# EasyEDA Pro project ProPrj_Flight Radar_Time Sketch_2026-05-02.epro

# Schematic Schematic1
Board Name: Board1; Create Date: 2026-01-16; Page Name: P1; Project Name: Flight Radar/Time Sketch; Schematic Name: Schematic1; Update Date: 2026-01-16; Company: EasyEDA.com; Page Size: A4; Version: V1.0
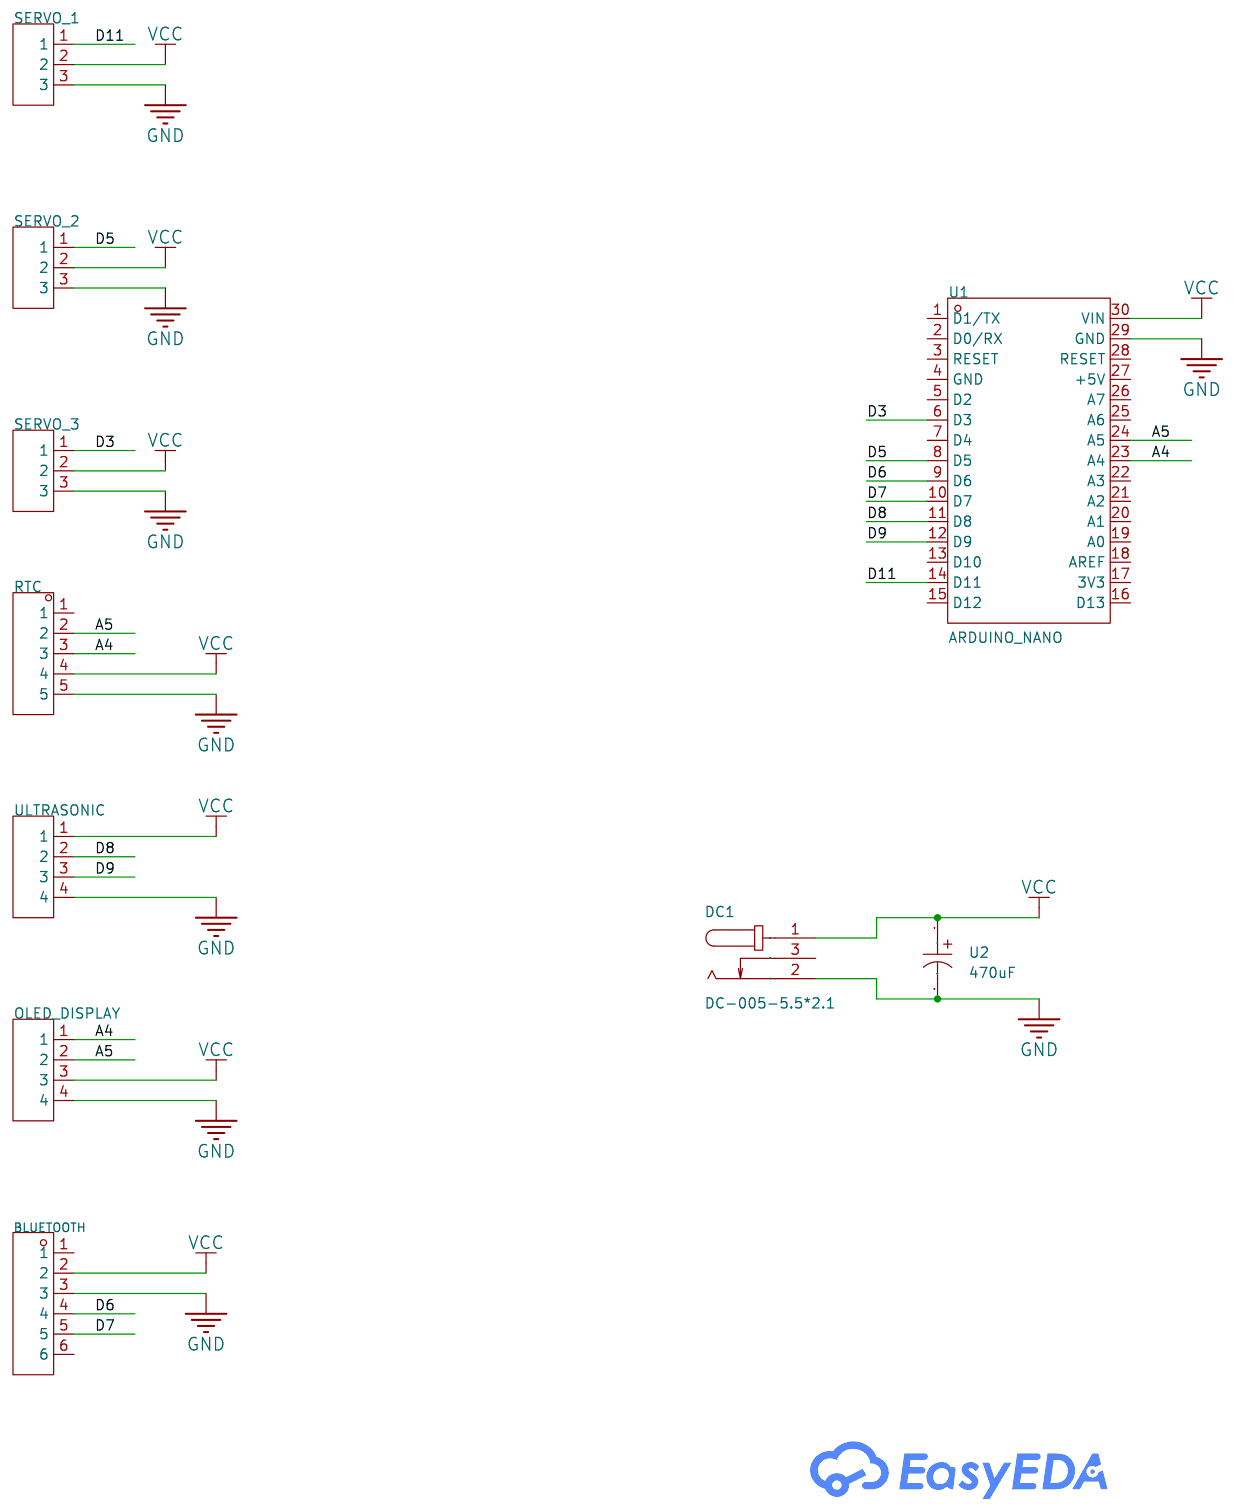
[diagram p0: schematic sheet]

## Parts
BLUETOOTH  -  [HDR-TH_6P-P2.54-V-F]
DC1  DC-005-5.5*2.1  [DC-IN-TH_DC-005-2]
OLED_DISPLAY  -  [HDR-TH_4P-P2.54-V-M]
RTC  -  [HDR-TH_5P-P2.54-V-M]
SERVO_1  -  [HDR-TH_3P-P2.54-V-M]
SERVO_2  -  [HDR-TH_3P-P2.54-V-M]
SERVO_3  -  [HDR-TH_3P-P2.54-V-M]
U1  ARDUINO_NANO  [COMM-TH_ARDUINO_NANO]
U2  470uF  [CAP-TH_BD6.3-P2.50-D1.0-FD]
ULTRASONIC  -  [HDR-TH_4P-P2.54-V-M]

## Library data of the parts
BLUETOOTH = HDR-F_2.54_1x6P: Supplier Footprint: Through
DC1 = DC-005-5.5*2.1: Supplier Part: C9900017044; Supplier Footprint: DC-005; JLCPCB Part Class: Extended Part; Supplier: LCSC
OLED_DISPLAY ULTRASONIC = HDR-M_2.54_1x4P: Supplier Footprint: Through
RTC = HDR-M_2.54_1x5P: Supplier Footprint: Through
SERVO_1-SERVO_3 = HDR-M_2.54_1x3P: Supplier Footprint: Through
U1 = ARDUINO_NANO: Supplier Part: C9900017879; Supplier Footprint: 插件; JLCPCB Part Class: Extended Part; Supplier: LCSC
U2 = RS471M160E100R1Z00ZZ: Capacitance:470uF Tolerance:±20% Tolerance:±20% Rated Voltage: Ripple Current:4.5A@100kHz Equivalent Series Resistance(ESR):14mΩ@100kHz Lead Spacing:2.5mm φD:6.3mm L: Lifetime @ Temp:2000hrs@105℃ Operating Temperature:-55℃~+105℃ Operating Temperature:-55℃; LCSC Part Name: 470uF 16V ±20%; Supplier Part: C41355790; Manufacturer: 创慧电子; Supplier Footprint: 插件,D6.3xL10mm; Datasheet: https://atta.szlcsc.com/upload/public/pdf/source/20240816/9C014D29003B33F9434FC27EF087CC87.pdf; Supplier: LCSC; Tolerance: ±20%; Ripple Current: 4.5A@100kHz; Equivalent Series Resistance(ESR): 14mΩ@100kHz; Lead Spacing: 2.5mm; φD: 6.3mm; Lifetime @ Temp: 2000hrs@105℃; Operating Temperature: -55℃~+105℃

## Nets
GND: BLUETOOTH.3 DC1.2 OLED_DISPLAY.4 RTC.5 SERVO_1.3 SERVO_2.3 SERVO_3.3 U1.29(GND) U2.2 ULTRASONIC.4
VCC: BLUETOOTH.2 DC1.1 OLED_DISPLAY.3 RTC.4 SERVO_1.2 SERVO_2.2 SERVO_3.2 U1.30(VIN) U2.1 ULTRASONIC.1
A4: OLED_DISPLAY.1 RTC.3 U1.23(A4)
A5: OLED_DISPLAY.2 RTC.2 U1.24(A5)
D3: SERVO_3.1 U1.6(D3)
D5: SERVO_2.1 U1.8(D5)
D6: BLUETOOTH.4 U1.9(D6)
D7: BLUETOOTH.5 U1.10(D7)
D8: U1.11(D8) ULTRASONIC.2
D9: U1.12(D9) ULTRASONIC.3
D11: SERVO_1.1 U1.14(D11)

Not connected (* = marked no-connect by the designer): BLUETOOTH 1 6; DC1 3; RTC 1; U1 1(D1/TX) 2(D0/RX) 3(RESET) 4(GND) 5(D2) 7(D4) 13(D10) 15(D12) 16(D13) 17(3V3) 18(AREF) 19(A0) 20(A1) 21(A2) 22(A3) 25(A6) 26(A7) 27(+5V) 28(RESET)

# Board PCB1
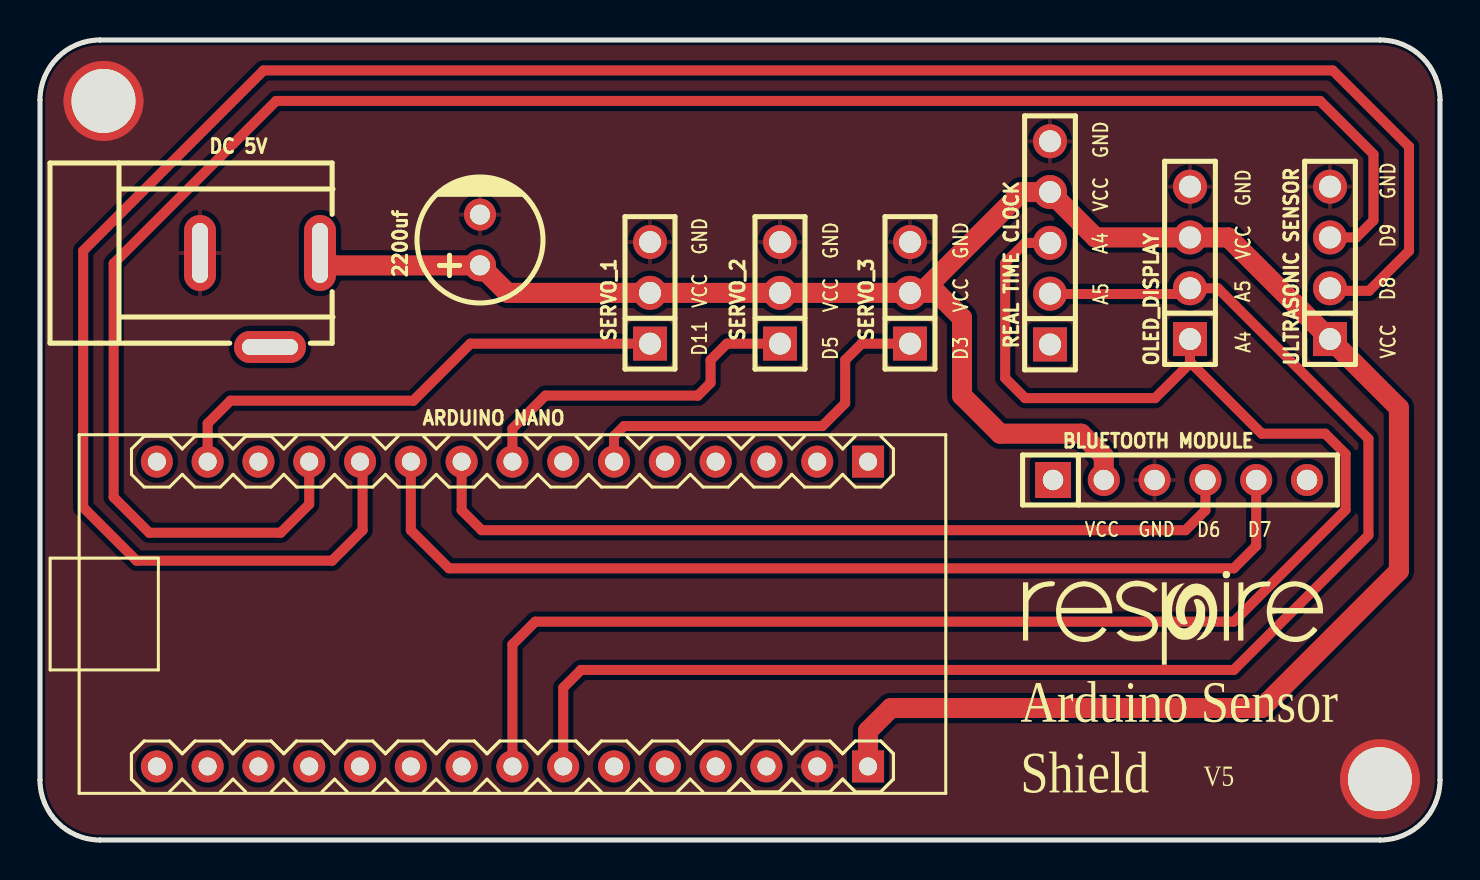
[diagram p1: board, top side]
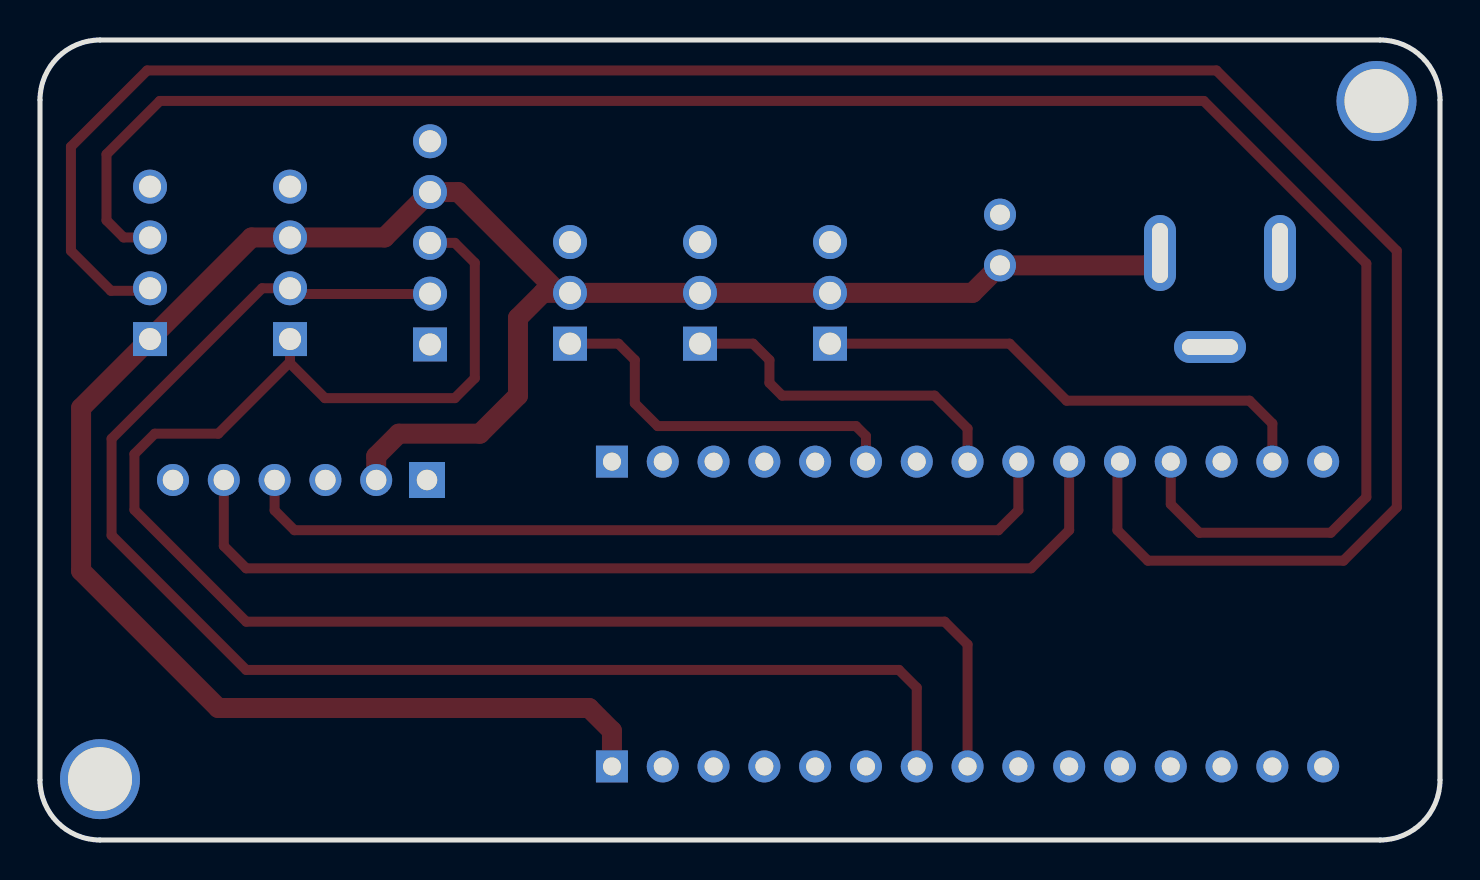
[diagram p2: board, bottom side, seen from below]

Outline 70 x 40 mm; copper layers: Top Layer, Bottom Layer. Coordinates in mm from the lower left corner of the outline.
Outline path: 0,37 0,3 arc(0.88,0.88) 3,0 67,0 arc(69.12,0.88) 70,3 70,37 arc(69.12,39.12) 67,40 3,40 arc(0.88,39.12) 0,37
Stack: Top Layer 0.035mm / Dielectric1 1.51mm FR4 er 4.5 / Bottom Layer 0.035mm

## Design rules (mm)
template: Custom Config
spacing copperThickness1oz (default): track to track 0.102, other pairs 0.152 to 0.3
spacing copperThickness2oz: track to track 0.203, other pairs 0.152 to 0.3
track width copperThickness1oz (default): min 0.127, default 1, max 2.54
track width copperThickness2oz: min 0.203, default 1, max 2.54
differential pair differentialPair (default): width min 0.127, default 0.254, max 2.54; gap min 0.152, default 0.152
via viaSize (default): diameter min 0.5, default 0.61, max 10; hole min 0.3, default 0.305, max 6.3

## Placement (name value [footprint] x y rotation side)
2200uf  470uF  [CAP-TH_BD6.3-P2.50-D1.0-FD]  22 30 90 top
ARDUINO NANO  ARDUINO_NANO  [COMM-TH_ARDUINO_NANO]  23.62 11.3 0 top
BLUETOOTH MODULE  -  [HDR-TH_6P-P2.54-V-F]  57 18 0 top
DC 5V  DC-005-5.5*2.1  [DC-IN-TH_DC-005-2]  11 27 0 top
NOREF  -  [Pad_e17]  3.17 36.95 0 top
NOREF#2  -  [Pad_e19]  67 3.04 0 top
OLED_DISPLAY  -  [HDR-TH_4P-P2.54-V-M]  57.5 28.86 90 top
REAL TIME CLOCK  -  [HDR-TH_5P-P2.54-V-M]  50.5 29.86 90 top
SERVO_1  -  [HDR-TH_3P-P2.54-V-M]  30.5 27.36 90 top
SERVO_2  -  [HDR-TH_3P-P2.54-V-M]  37 27.36 90 top
SERVO_3  -  [HDR-TH_3P-P2.54-V-M]  43.5 27.36 90 top
ULTRASONIC SENSOR  -  [HDR-TH_4P-P2.54-V-M]  64.5 28.86 90 top

## Footprints (pads in the part's own frame, mm; a bottom-side part is the same pattern mirrored in y, then rotated)
CAP-TH_BD6.3-P2.50-D1.0-FD
  round 1.6 hole 1: 1(-1.27,0) 2(1.27,0)
COMM-TH_ARDUINO_NANO
  rect 1.6x1.6 hole 0.9: 1(17.78,7.62) 30(17.78,-7.62)
  round 1.6 hole 0.9: 2(15.24,7.62) 3(12.7,7.62) 4(10.16,7.62) 5(7.62,7.62) 6(5.08,7.62) 7(2.54,7.62) 8(0,7.62) 9(-2.54,7.62) 10(-5.08,7.62) 11(-7.62,7.62) 12(-10.16,7.62) 13(-12.7,7.62) 14(-15.24,7.62) 15(-17.78,7.62) 16(-17.78,-7.62) 17(-15.24,-7.62) 18(-12.7,-7.62) 19(-10.16,-7.62) 20(-7.62,-7.62) 21(-5.08,-7.62) 22(-2.54,-7.62) 23(0,-7.62) 24(2.54,-7.62) 25(5.08,-7.62) 26(7.62,-7.62) 27(10.16,-7.62) 28(12.7,-7.62) 29(15.24,-7.62)
DC-IN-TH_DC-005-2
  oval 1.6x3.8 hole 0.8x3: 1(2.999,2.35) 2(-3,2.35)
  oval 3.6x1.6 hole 2.8x0.8: 3(0.5,-2.35)
HDR-TH_3P-P2.54-V-M
  rect 1.7x1.7 hole 1.1: 1(-2.54,0)
  round 1.7 hole 1.1: 2(0,0) 3(2.54,0)
HDR-TH_4P-P2.54-V-M
  rect 1.7x1.7 hole 1.1: 1(-3.81,0)
  round 1.7 hole 1.1: 2(-1.27,0) 3(1.27,0) 4(3.81,0)
HDR-TH_5P-P2.54-V-M
  rect 1.7x1.7 hole 1.1: 1(-5.08,0)
  round 1.7 hole 1.1: 2(-2.54,0) 3(0,0) 4(2.54,0) 5(5.08,0)
HDR-TH_6P-P2.54-V-F
  rect 1.8x1.8 hole 1.02: 1(-6.35,0)
  round 1.6 hole 1.02: 2(-3.81,0) 3(-1.27,0) 4(1.27,0) 5(3.81,0) 6(6.35,0)
Pad_e17
  round 4 hole 3.2: 1(0,0)
Pad_e19
  round 4 hole 3.2: 1(0,0)

## Nets
GND: 2200uf.2 ARDUINO NANO.29 BLUETOOTH MODULE.3 DC 5V.2 NOREF.1 NOREF#2.1 OLED_DISPLAY.4 REAL TIME CLOCK.5 SERVO_1.3 SERVO_2.3 SERVO_3.3 ULTRASONIC SENSOR.4
VCC: 2200uf.1 ARDUINO NANO.30 BLUETOOTH MODULE.2 DC 5V.1 OLED_DISPLAY.3 REAL TIME CLOCK.4 SERVO_1.2 SERVO_2.2 SERVO_3.2 ULTRASONIC SENSOR.1
A4: ARDUINO NANO.23 OLED_DISPLAY.1 REAL TIME CLOCK.3
A5: ARDUINO NANO.24 OLED_DISPLAY.2 REAL TIME CLOCK.2
D3: ARDUINO NANO.6 SERVO_3.1
D5: ARDUINO NANO.8 SERVO_2.1
D6: ARDUINO NANO.9 BLUETOOTH MODULE.4
D7: ARDUINO NANO.10 BLUETOOTH MODULE.5
D8: ARDUINO NANO.11 ULTRASONIC SENSOR.2
D9: ARDUINO NANO.12 ULTRASONIC SENSOR.3
D11: ARDUINO NANO.14 SERVO_1.1

Pads without a net: ARDUINO NANO 1 2 3 4 5 7 13 15 16 17 18 19 20 21 22 25 26 27 28; BLUETOOTH MODULE 1 6; DC 5V 3; REAL TIME CLOCK 1

## Routing (per net, layer and track width the routed paths; a pad name or vN(x,y) marks a point on that pad's centre or on a via; arc(x,y) is an arc through that point)
VCC: length 117.1
  Top Layer w1: 44.05,27.36 SERVO_3.2 SERVO_2.2 SERVO_1.2 23.37,27.36 2200uf.1 14.62,28.73 DC 5V.1 ; 44.05,27.36 44.85,27.36 46.1,26.1 46.1,22.22 48.01,20.31 52.06,20.31 53.19,19.19 BLUETOOTH MODULE.2 ; 44.05,27.36 49.09,32.4 REAL TIME CLOCK.4 52.77,30.13 OLED_DISPLAY.3 59.42,30.13 ULTRASONIC SENSOR.1 67.94,21.6 67.94,13.46 61.09,6.6 42.54,6.6 41.4,5.46 ARDUINO NANO.30
A4: length 83
  Top Layer w0.5: ARDUINO NANO.23 23.62,9.77 24.76,10.92 59.69,10.92 65.28,16.5 65.28,19.3 64.26,20.31 61.09,20.31 57.5,23.9 OLED_DISPLAY.1 ; 57.5,23.84 55.75,22.09 49.26,22.09 48.26,23.09 48.26,28.86 49.26,29.86 REAL TIME CLOCK.3
A5: length 71.3
  Top Layer w0.5: REAL TIME CLOCK.2 50.52,27.3 57.21,27.3 OLED_DISPLAY.2 58.9,27.59 66.42,20.06 66.42,15.23 59.69,8.5 27.05,8.5 26.16,7.61 ARDUINO NANO.24
D3: length 19.3
  Top Layer w0.5: SERVO_3.1 41.08,24.82 40.26,24 40.26,21.84 39.12,20.7 29.2,20.7 28.7,20.2 ARDUINO NANO.6
D5: length 17.5
  Top Layer w0.5: ARDUINO NANO.8 23.62,20.57 25.27,22.22 32.89,22.22 33.53,22.86 33.53,24 34.35,24.82 SERVO_2.1
D6: length 42
  Top Layer w0.5: ARDUINO NANO.9 21.08,16.49 22.08,15.49 57.28,15.49 58.27,16.48 BLUETOOTH MODULE.4
D7: length 50.2
  Top Layer w0.5: ARDUINO NANO.10 18.54,15.49 20.45,13.58 59.69,13.58 60.81,14.7 BLUETOOTH MODULE.5
D8: length 113.7
  Top Layer w0.5: ARDUINO NANO.11 16.13,18.79 16.13,15.49 14.61,13.97 4.83,13.97 2.16,16.63 2.16,29.46 11.18,38.48 64.64,38.48 68.45,34.67 68.45,29.46 66.45,27.46 64.63,27.46 ULTRASONIC SENSOR.2
D9: length 98.2
  Top Layer w0.5: ULTRASONIC SENSOR.3 65.82,30.13 66.68,30.98 66.68,34.28 64.01,36.95 11.81,36.95 3.68,28.82 3.68,17.14 5.46,15.36 12.03,15.36 13.46,16.79 ARDUINO NANO.12
D11: length 25.7
  Top Layer w0.5: SERVO_1.1 21.52,24.82 18.67,21.97 9.53,21.97 8.38,20.82 ARDUINO NANO.14

## Copper pours and planes (outline as drawn; the poured copper is in the pictures)
GND on Top Layer: -3.81,44.06 71.63,44.06 71.63,-2.29 -3.81,-2.29

## Text on the board
Top Silkscreen Layer: D11 | GND | VCC | D5 | D3 | A4 | A5 | D8 | D9 | D6 | D7 | V5 | Arduino Sensor / Shield
